# Altium schematic sheet levelshift6x.SchDoc
size A
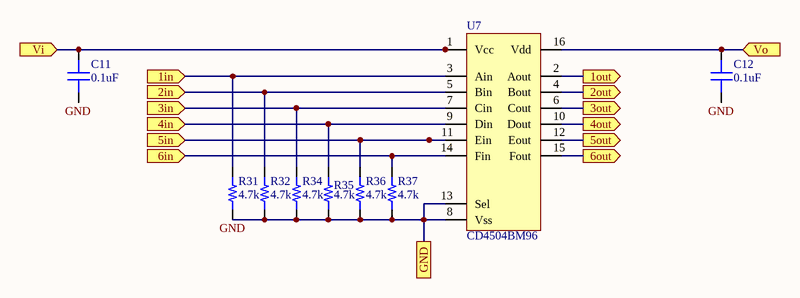
[diagram p0: levelshift6x.SchDoc]

## Parts
C11  capacitance: 0.1uF  [0603]  (hidden comment: capacitor)
C12  capacitance: 0.1uF  [0603]  (hidden comment: capacitor)
R31  resistance: 4.7k  [0603]  (hidden comment: resistor)
R32  resistance: 4.7k  [0603]  (hidden comment: resistor)
R34  resistance: 4.7k  [0603]  (hidden comment: resistor)
R35  resistance: 4.7k  [0603]  (hidden comment: resistor)
R36  resistance: 4.7k  [0603]  (hidden comment: resistor)
R37  resistance: 4.7k  [0603]  (hidden comment: resistor)
U7  CD4504BM96  [SOIC-16]

## Ports
1in (in), 1out (out), 2in (in), 2out (out), 3in (in), 3out (out), 4in (in), 4out (out), 5in (in), 5out (out), 6in (in), 6out (out), GND, Vi (in), Vo (in)

## Nets
1in: R31.2 U7.3(Ain) ; port 1in
1out: U7.2(Aout) ; port 1out
2in: R32.2 U7.5(Bin) ; port 2in
2out: U7.4(Bout) ; port 2out
3in: R34.2 U7.7(Cin) ; port 3in
3out: U7.6(Cout) ; port 3out
4in: R35.2 U7.9(Din) ; port 4in
4out: U7.10(Dout) ; port 4out
5in: R36.2 U7.11(Ein) ; port 5in
5out: U7.12(Eout) ; port 5out
6in: R37.2 U7.14(Fin) ; port 6in
6out: U7.15(Fout) ; port 6out
GND: C11.1 C12.1 R31.1 R32.1 R34.1 R35.1 R36.1 R37.1 U7.8(Vss) U7.13(Sel) ; port GND
Vi: C11.2 U7.1(Vcc) ; port Vi
Vo: C12.2 U7.16(Vdd) ; port Vo

## Library data of the parts
C11 C12 = 1: Generic 0603 capacitor; id: 1
R31 R32 R34-R37 = 1: id: 1
U7 = 1: Voltage Level Translator Unidirectional 1 Cir; id: 1; Vcc: 20; Name: CD4504BM96; type: Level shifter CMOS-CMOS; package: SOIC-16; quantity: 0; link: https://www.digikey.com/product-detail/en/texas-instruments/CD4504BM96/296-14150-2-ND/525968